# EAGLE design Placa Sensores 2019 (EAGLE 7.2.0)
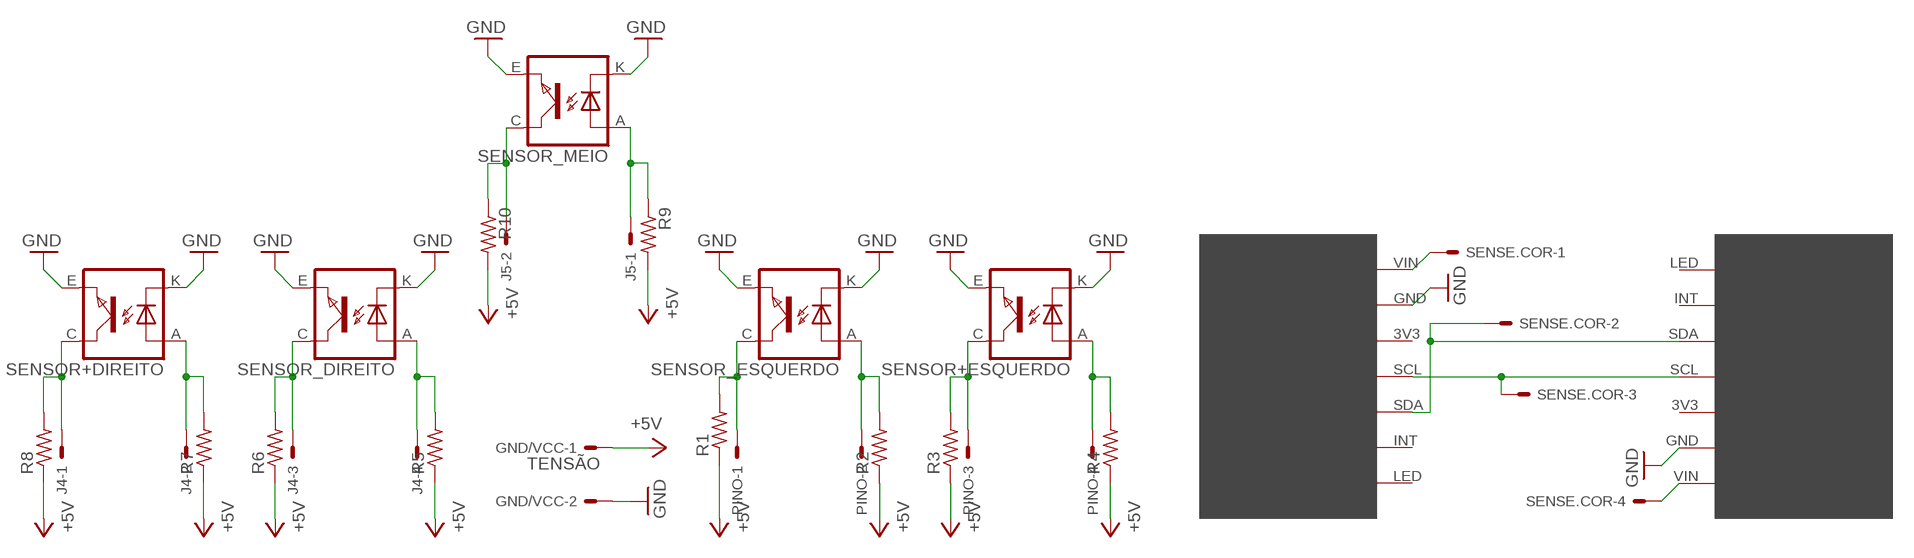
[diagram p0: schematic, sheet 1]

## Parts
GND/VCC  TENSÃO  CONN_0227-2021  [6410-02]
J4  CONN_0427-2041  [6410-04]
J5  CONN_0227-2021  [6410-02]
PINO  CONN_0427-2041  [6410-04]
R1  R-US_0207/12  [0207/12]
R2  R-US_0207/12  [0207/12]
R3  R-US_0207/12  [0207/12]
R4  R-US_0207/12  [0207/12]
R5  R-US_0207/12  [0207/12]
R6  R-US_0207/12  [0207/12]
R7  R-US_0207/12  [0207/12]
R8  R-US_0207/12  [0207/12]
R9  R-US_0204/7  [0204/7]
R10  R-US_0204/7  [0204/7]
SENSE.COR  CONN_0427-2041  [6410-04]
SENSOR+DIREITO  TCRT5000  [TCRT5000]
SENSOR+ESQUERDO  TCRT5000  [TCRT5000]
SENSOR_DIREITO  TCRT5000  [TCRT5000]
SENSOR_ESQUERDO  TCRT5000  [TCRT5000]
SENSOR_MEIO  TCRT5000  [TCRT5000]
TCS1  TCS34725  [TCS34725]
TCS2  TCS34725  [TCS34725]

## Nets
+5V: GND/VCC.1 R1.1 R2.1 R3.1 R4.1 R5.1 R6.1 R7.1 R8.1 R9.2 R10.2
GND: GND/VCC.2 SENSOR+DIREITO.E(EMITTER) SENSOR+DIREITO.K(CATHODE) SENSOR+ESQUERDO.E(EMITTER) SENSOR+ESQUERDO.K(CATHODE) SENSOR_DIREITO.E(EMITTER) SENSOR_DIREITO.K(CATHODE) SENSOR_ESQUERDO.E(EMITTER) SENSOR_ESQUERDO.K(CATHODE) SENSOR_MEIO.E(EMITTER) SENSOR_MEIO.K(CATHODE) TCS1.GND TCS2.GND
N$1: SENSE.COR.1 TCS1.VIN
N$2: SENSE.COR.2 TCS1.SDA TCS2.SDA
N$3: SENSE.COR.3 TCS1.SCL TCS2.SCL
N$4: SENSE.COR.4 TCS2.VIN
N$5: PINO.3 R3.2 SENSOR+ESQUERDO.C(COLLECTOR)
N$6: PINO.2 R2.2 SENSOR_ESQUERDO.A(ANODE)
N$7: J4.4 R5.2 SENSOR_DIREITO.A(ANODE)
N$8: PINO.4 R4.2 SENSOR+ESQUERDO.A(ANODE)
N$9: PINO.1 R1.2 SENSOR_ESQUERDO.C(COLLECTOR)
N$10: J5.2 R10.1 SENSOR_MEIO.C(COLLECTOR)
N$11: J5.1 R9.1 SENSOR_MEIO.A(ANODE)
N$13: J4.3 R6.2 SENSOR_DIREITO.C(COLLECTOR)
N$15: J4.2 R7.2 SENSOR+DIREITO.A(ANODE)
N$17: J4.1 R8.2 SENSOR+DIREITO.C(COLLECTOR)
Unconnected: TCS1.3V3 TCS1.INT TCS1.LED TCS2.3V3 TCS2.INT TCS2.LED

## Library data of the parts
GND/VCC J5 = Robotica-IFRN-SC-conectores:CONN_02: CONNECTOR wire to board 2.54 mm (.1 inch) pitch header; OC_FARNELL: unknown; OC_NEWARK: unknown
J4 PINO SENSE.COR = Robotica-IFRN-SC-conectores:CONN_04: CONNECTOR wire to board 2.54 mm (.1 inch) pitch header; OC_FARNELL: unknown; OC_NEWARK: unknown
R1-R10 = rcl:R-US_: RESISTOR, American symbol
SENSOR+DIREITO SENSOR+ESQUERDO SENSOR_DIREITO SENSOR_ESQUERDO SENSOR_MEIO = Robotica-IFRN-SC-sensores:TCRT5000
TCS1 TCS2 = Robotica-IFRN-SC-sensores:TCS34725: Sensor de cor TCS34725

## Board
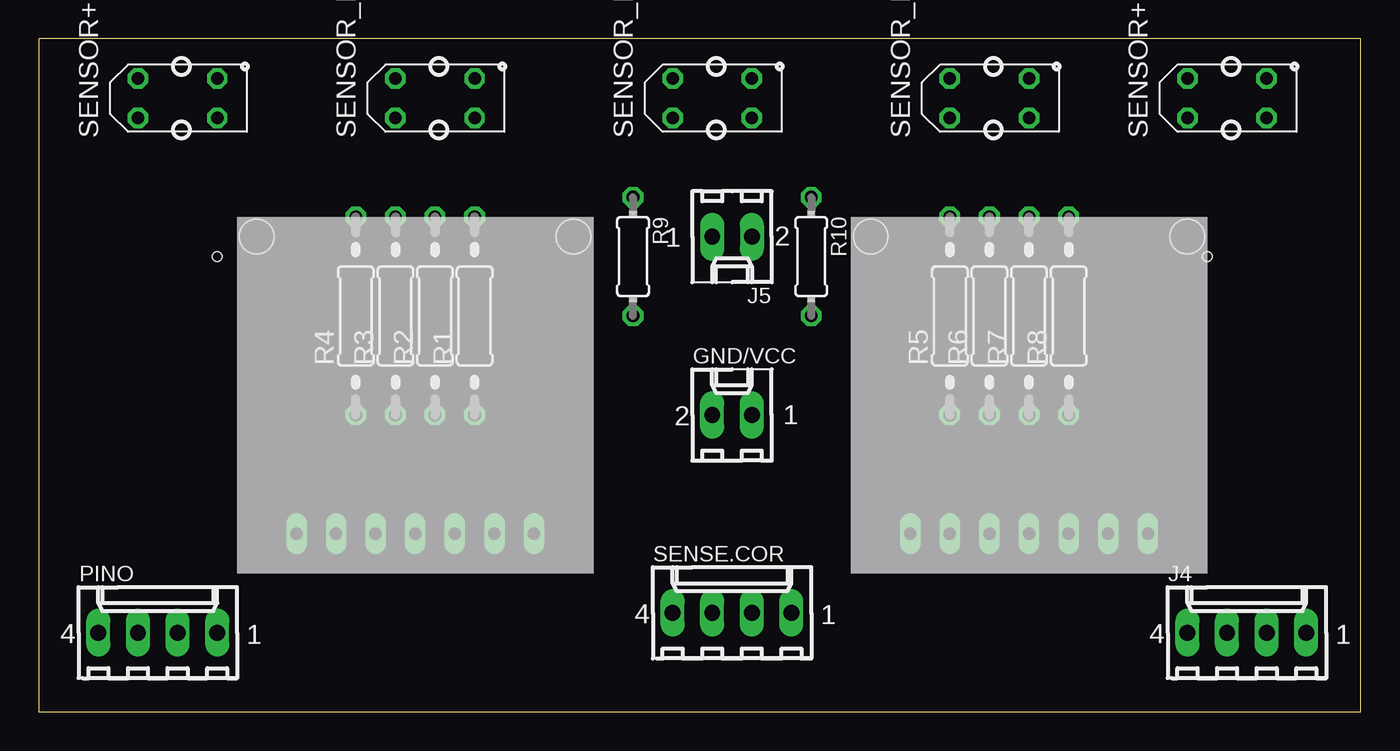
[diagram p1: board, top side]
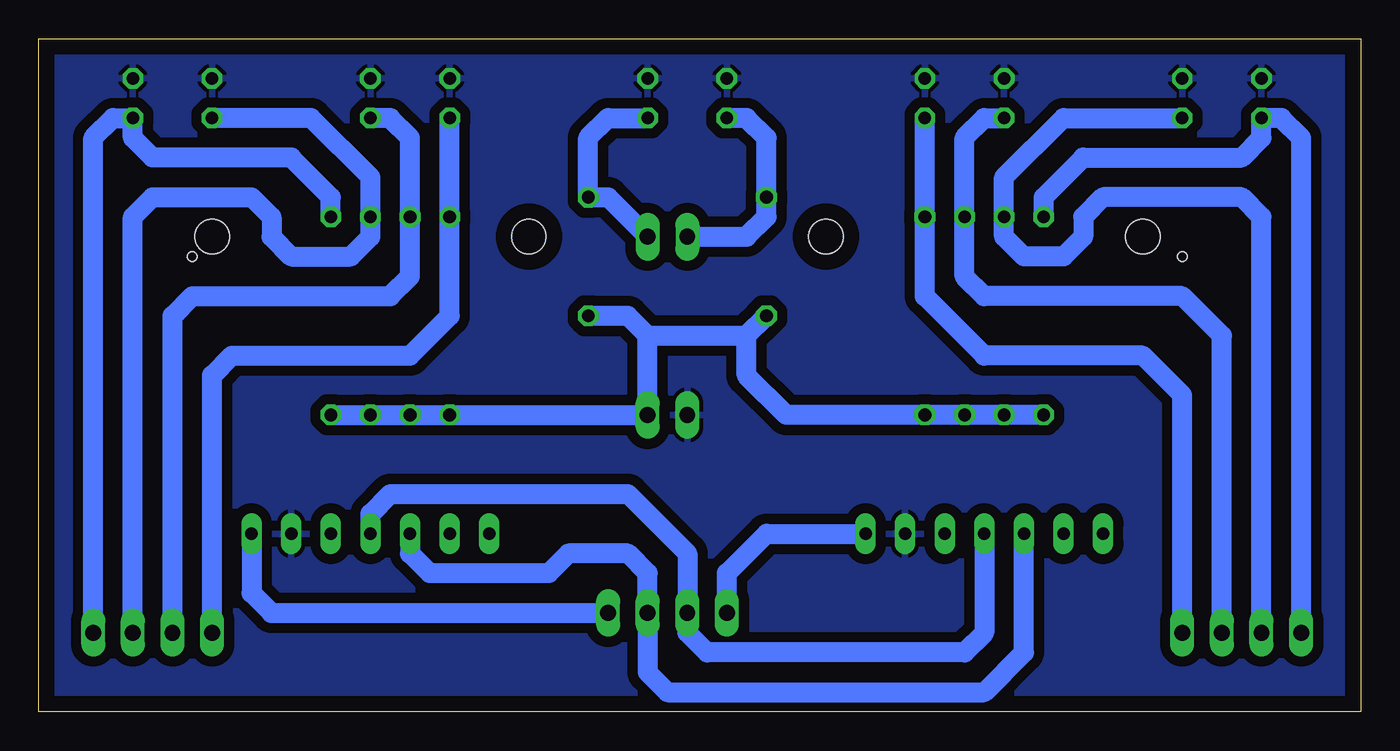
[diagram p2: board, bottom side, seen from below]

Size 84.76 x 43.17 mm. Coordinates in mm from the lower left corner, seen from the top.
Outline: 0,0 84.76,0 84.76,43.17 0,43.17 0,0
Copper layers (1*16): Top 0.035mm / dielectric 1.5mm / Bottom 0.035mm
Design rules "default *": minimum track width 50mil, minimum drill 24mil, track to track 26mil, track to pad 26mil, pad to pad 26mil, via to via 26mil, smd to smd 8mil, copper to edge 40mil, drill to drill 8mil, minimum pad ring 10mil, minimum via ring 8mil, stop-mask expansion 4mil, vias tented up to drill 0mil, thermal gap 10mil
Holes 0.6 mm at 11.43,29.21 74.93,29.21

### Footprints (pad centres in the part's own frame; a part is rotated, then mirrored left to right if it is on the bottom)
6410-02 = drill 1.016 long: 1 1.27,0; 2 -1.27,0
6410-04 = drill 1.016 long: 1 3.81,0; 2 1.27,0; 3 -1.27,0; 4 -3.81,0
0207/12 = drill 0.813 octagon: 1 -6.35,0; 2 6.35,0
0204/7 = drill 0.813 octagon: 1 -3.81,0; 2 3.81,0
TCRT5000 = drill 0.8 octagon: A -2.54,-1.27; C 2.54,-1.27; E 2.54,1.27; K -2.54,1.27
TCS34725 = drill 0.8 long: 3V3 0,-5.08; GND 2.54,-5.08; INT -7.62,-5.08; LED -10.16,-5.08; SCL -2.54,-5.08; SDA -5.08,-5.08; VIN 5.08,-5.08 | hole 2.2: -12.7,13.97; 7.62,13.97

### Placement (x,y rotation side)
GND/VCC  44.45,19.05 0 top
J4  77.47,5.08 0 top
J5  44.45,30.48 180 top
PINO  7.62,5.08 0 top
R1  27.94,25.4 90 top
R2  25.4,25.4 90 top
R3  22.86,25.4 90 top
R4  20.32,25.4 90 top
R5  58.42,25.4 90 top
R6  60.96,25.4 90 top
R7  63.5,25.4 90 top
R8  66.04,25.4 90 top
R9  38.1,29.21 270 top
R10  49.53,29.21 270 top
SENSE.COR  44.45,6.35 0 top
SENSOR+DIREITO  76.2,39.37 0 top
SENSOR+ESQUERDO  8.89,39.37 0 top
SENSOR_DIREITO  60.96,39.37 0 top
SENSOR_ESQUERDO  25.4,39.37 0 top
SENSOR_MEIO  43.18,39.37 0 top
TCS1  66.04,16.51 0 top
TCS2  26.67,16.51 0 top

### Tracks (layer width: path | path; a pad name or v marks a point on that pad's centre or on a via)
+5V
  Bottom 1.27: R8.1 R7.1 R6.1 R5.1 GND/VCC.1 45.72,24.13 | R4.1 R3.1 R2.1 R1.1 36.83,19.05 39.37,21.59 39.37,24.13 | 45.72,24.13 46.99,25.4 R10.2 | 45.72,24.13 39.37,24.13 | 39.37,24.13 R9.2
GND
  pour Bottom: 0,0 0,43.18 85.09,43.18 85.09,0
N$1
  Bottom 1.27: TCS1.VIN 71.12,7.62 69.85,6.35 SENSE.COR.1
N$2
  Bottom 1.27: TCS1.SDA 60.96,10.16 59.69,8.89 52.07,8.89 50.8,10.16 46.99,10.16 45.72,8.89 SENSE.COR.2 45.72,2.54 44.45,1.27 24.13,1.27 21.59,3.81 TCS2.SDA
N$3
  Bottom 1.27: TCS2.SCL 24.13,5.08 25.4,3.81 41.91,3.81 43.18,5.08 SENSE.COR.3 43.18,10.16 46.99,13.97 62.23,13.97 63.5,12.7 TCS1.SCL
N$4
  Bottom 1.27: SENSE.COR.4 40.64,8.89 38.1,11.43 TCS2.VIN
N$5
  Bottom 1.27: SENSOR+ESQUERDO.C 19.05,38.1 22.86,34.29 R3.2 22.86,30.48 21.59,29.21 19.05,29.21 17.78,30.48 17.78,31.75 16.51,33.02 7.62,33.02 6.35,31.75 PINO.3
N$6
  Bottom 1.27: SENSOR_ESQUERDO.A 24.13,38.1 25.4,36.83 R2.2 25.4,27.94 24.13,26.67 11.43,26.67 8.89,24.13 PINO.2
N$7
  Bottom 1.27: SENSOR_DIREITO.A R5.2 58.42,25.4 60.96,22.86 72.39,22.86 73.66,21.59 J4.4
N$8
  Bottom 1.27: R4.2 20.32,33.02 17.78,35.56 7.62,35.56 6.35,36.83 SENSOR+ESQUERDO.A 5.08,38.1 3.81,36.83 PINO.4
N$9
  Bottom 1.27: SENSOR_ESQUERDO.C R1.2 27.94,26.67 24.13,22.86 13.97,22.86 11.43,20.32 PINO.1
N$10
  Bottom 1.27: J5.2 48.26,33.02 R10.1 49.53,36.83 48.26,38.1 SENSOR_MEIO.C
N$11
  Bottom 1.27: J5.1 39.37,30.48 38.1,31.75 R9.1 38.1,36.83 39.37,38.1 SENSOR_MEIO.A
N$13
  Bottom 1.27: SENSOR_DIREITO.C 62.23,38.1 60.96,36.83 R6.2 60.96,27.94 62.23,26.67 74.93,26.67 76.2,25.4 J4.3
N$15
  Bottom 1.27: SENSOR+DIREITO.A 67.31,38.1 63.5,34.29 R7.2 63.5,30.48 64.77,29.21 68.58,29.21 69.85,30.48 69.85,31.75 71.12,33.02 77.47,33.02 78.74,31.75 J4.2
N$17
  Bottom 1.27: J4.1 81.28,36.83 80.01,38.1 SENSOR+DIREITO.C 78.74,36.83 77.47,35.56 68.58,35.56 66.04,33.02 R8.2